# Altium schematic sheet MCU.SchDoc
size A4
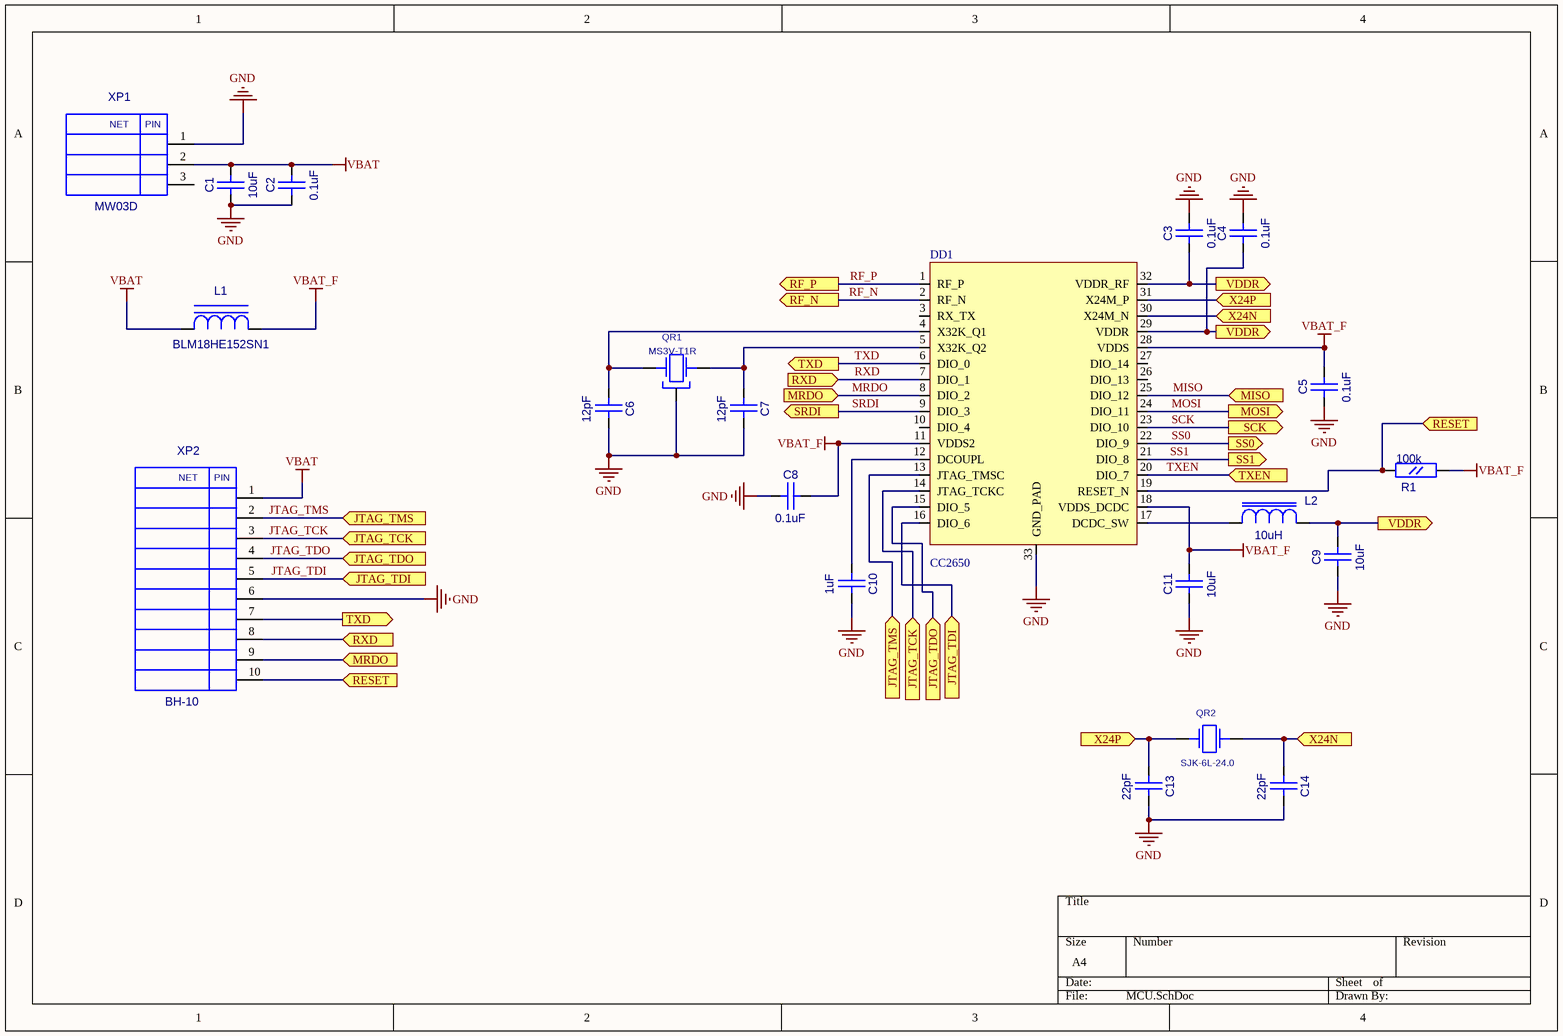
[diagram p0: MCU.SchDoc]

## Parts
C1  10uF  [CC0805]
C2  0.1uF  [CC0603]
C3  0.1uF  [CC0603]
C4  0.1uF  [CC0603]
C5  0.1uF  [CC0603]
C6  12pF  [CC0603]
C7  12pF  [CC0603]
C8  0.1uF  [CC0603]
C9  10uF  [CC0805]
C10  1uF  [CC0603]
C11  10uF  [CC0805]
C13  22pF  [CC0603]
C14  22pF  [CC0603]
DD1  CC2650  [QFN32_TI]
L1  BLM18HE152SN1  [L0603]
L2  10uH  [RC0805]
QR1  MS3V-T1R  [MS3V-T1R]
QR2  SJK-6L-24.0  [AC5032_2]
R1  100k  [RC0603]
XP1  MW03D  [MW03D]
XP2  BH-10  [BH-10]

## Ports
JTAG_TCK (in), JTAG_TDI (in), JTAG_TDO (in), JTAG_TMS (in), MISO (in), MOSI (out), MRDO (in), RESET (in), RF_N (out), RF_P (out), RXD (in), SCK (out), SRDI (out), SS0 (out), SS1 (out), TXD (out), TXEN (in), VDDR (out), X24N (in), X24P (in)

## Nets
GND: C1.1(A) C2.1(A) C3.2(B) C4.2(B) C5.1(A) C6.2(B) C7.2(B) C8.1(A) C9.1(A) C10.2(B) C11.1(A) C13.2(B) C14.2(B) DD1.33(GND_PAD) QR1.3 XP1.1 XP2.6
VBAT: C1.2(B) C2.2(B) L1.1(A) XP1.2 XP2.1
VBAT_F: C5.2(B) C8.2(B) C11.2(B) DD1.11(VDDS2) DD1.18(VDDS_DCDC) DD1.28(VDDS) L1.2(C) R1.1(A)
JTAG_TCK: DD1.14(JTAG_TCKC) XP2.3 ; port JTAG_TCK
JTAG_TDI: DD1.16(DIO_6) XP2.5 ; port JTAG_TDI
JTAG_TDO: DD1.15(DIO_5) XP2.4 ; port JTAG_TDO
JTAG_TMS: DD1.13(JTAG_TMSC) XP2.2 ; port JTAG_TMS
MISO: DD1.25(DIO_12) ; port MISO
MOSI: DD1.24(DIO_11) ; port MOSI
MRDO: DD1.8(DIO_2) XP2.9 ; port MRDO
RESET: DD1.19(RESET_N) R1.2(B) XP2.10 ; port RESET
RF_N: DD1.2(RF_N) ; port RF_N
RF_P: DD1.1(RF_P) ; port RF_P
RXD: DD1.7(DIO_1) XP2.8 ; port RXD
SCK: DD1.23(DIO_10) ; port SCK
SRDI: DD1.9(DIO_3) ; port SRDI
SS0: DD1.22(DIO_9) ; port SS0
SS1: DD1.21(DIO_8) ; port SS1
TXD: DD1.6(DIO_0) XP2.7 ; port TXD
TXEN: DD1.20(DIO_7) ; port TXEN
VDDR: C3.1(A) C4.1(A) C9.2(B) DD1.29(VDDR) DD1.32(VDDR_RF) L2.2(B) ; port VDDR
X24N: C14.1(A) DD1.30(X24M_N) QR2.2 ; port X24N
X24P: C13.1(A) DD1.31(X24M_P) QR2.1 ; port X24P
NetC6_1: C6.1(A) DD1.4(X32K_Q1) QR1.2(X2)
NetC7_1: C7.1(A) DD1.5(X32K_Q2) QR1.1(X1)
NetC10_1: C10.1(A) DD1.12(DCOUPL)
NetDD1_17: DD1.17(DCDC_SW) L2.1(A)

Not connected (* = marked no-connect by the designer): DD1 3(RX_TX) 10(DIO_4) 26(DIO_13) 27(DIO_14); XP1 3

## Notes on the sheet
- (in symbol BH-10) NET; PIN
- (in symbol MW03D) NET; PIN

## Library data of the parts
C1 C9 C11 = CC0805: Value: 10uF
C2-C8 C10 C13 C14 = CC0603
  C2-C5 C8: Value: 0.1uF
  C6 C7: Value: 12pF
  C10: Value: 1uF
  C13 C14: Value: 22pF
DD1 = CC2650RHB: CC2650RHBT; Value: CC2650
L1 = L0603: Value: BLM18HE152SN1
L2 = L0805: Value: 10uH
QR1 = MS3V-T1R: CRYSTAL_32768 Hz; Value: *
QR2 = AC5032_2: AC5032/2; Value: SJK-6L-24.0
R1 = RC0603: Value: 100k
XP1 = MW03D: Value: *
XP2 = BH-10: Value: *